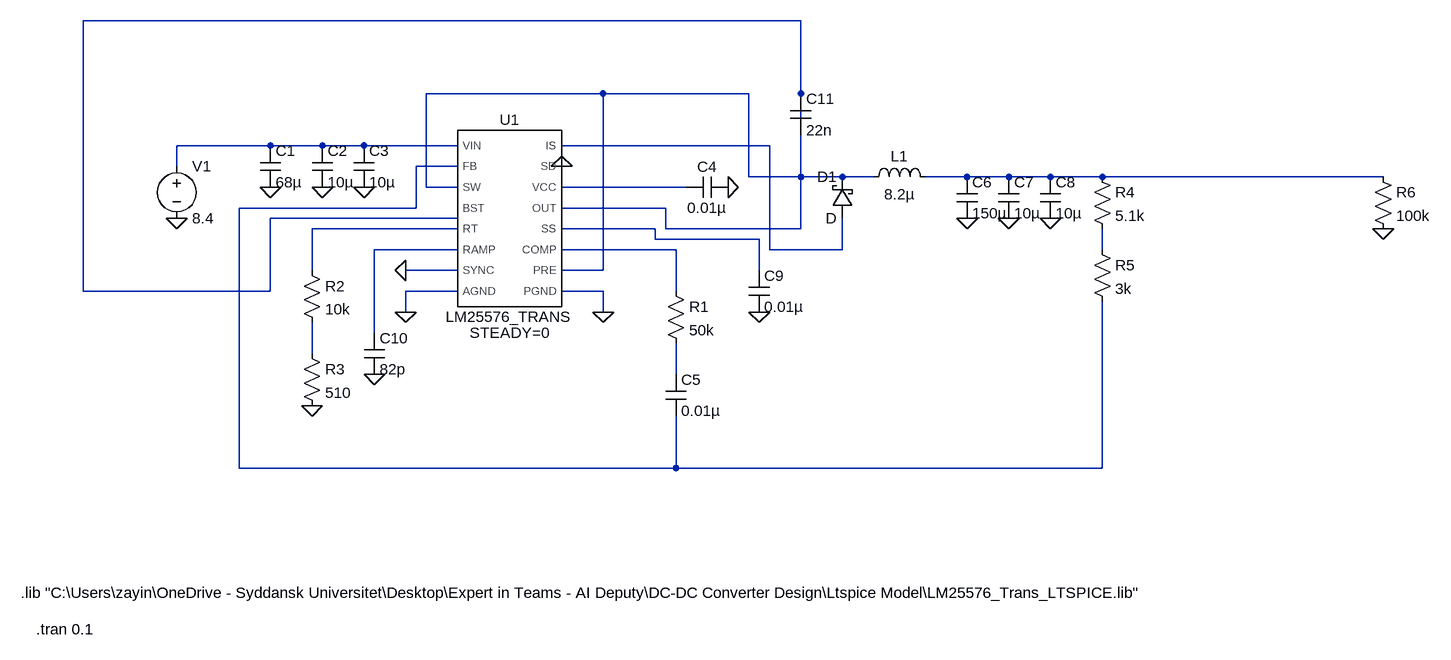
[diagram p0: schematic LM25576_LTSPICE_Simulation.asc]
LM25576_LTSPICE_Simulation.asc, the LTspice schematic file:
Version 4.1
SHEET 1 1616 824
WIRE 640 -128 -464 -128
WIRE 336 -16 64 -16
WIRE 560 -16 336 -16
WIRE 640 -16 640 -128
WIRE 640 32 640 -16
WIRE -176 64 -320 64
WIRE -96 64 -176 64
WIRE -32 64 -96 64
WIRE 112 64 -32 64
WIRE 592 64 272 64
WIRE -320 96 -320 64
WIRE 112 96 48 96
WIRE 560 112 560 -16
WIRE 640 112 640 48
WIRE 640 112 560 112
WIRE 704 112 640 112
WIRE 752 112 704 112
WIRE 896 112 832 112
WIRE 960 112 896 112
WIRE 1024 112 960 112
WIRE 1104 112 1024 112
WIRE 1536 112 1104 112
WIRE 64 128 64 -16
WIRE 112 128 64 128
WIRE 464 128 272 128
WIRE 48 160 48 96
WIRE 48 160 -224 160
WIRE 432 160 272 160
WIRE 112 176 112 160
WIRE 112 176 -176 176
WIRE 112 192 -112 192
WIRE 416 192 272 192
WIRE 432 192 432 160
WIRE 640 192 640 112
WIRE 640 192 432 192
WIRE 416 208 416 192
WIRE 576 208 416 208
WIRE 112 224 -16 224
WIRE 448 224 272 224
WIRE 592 224 592 64
WIRE 704 224 704 176
WIRE 704 224 592 224
WIRE 1104 224 1104 192
WIRE -112 256 -112 192
WIRE 112 256 32 256
WIRE 336 256 336 -16
WIRE 336 256 272 256
WIRE 576 256 576 208
WIRE -464 288 -464 -128
WIRE -176 288 -176 176
WIRE -176 288 -464 288
WIRE 112 288 32 288
WIRE 336 288 272 288
WIRE 448 288 448 224
WIRE 32 320 32 288
WIRE 336 320 336 288
WIRE -16 352 -16 224
WIRE -112 384 -112 336
WIRE 448 416 448 368
WIRE -224 560 -224 160
WIRE 448 560 448 480
WIRE 448 560 -224 560
WIRE 1104 560 1104 304
WIRE 1104 560 448 560
FLAG -320 176 0
FLAG 32 320 0
FLAG 336 320 0
FLAG -176 128 0
FLAG -96 128 0
FLAG -32 128 0
FLAG 32 256 0
FLAG -112 464 0
FLAG 528 128 0
FLAG 1536 192 0
FLAG 272 96 0
FLAG 576 320 0
FLAG -16 416 0
FLAG 896 176 0
FLAG 960 176 0
FLAG 1024 176 0
SYMBOL LM25576_TRANS 192 176 R0
SYMATTR InstName U1
SYMBOL voltage -320 80 R0
WINDOW 123 0 0 Left 0
WINDOW 39 0 0 Left 0
SYMATTR InstName V1
SYMATTR Value 8.4
SYMBOL cap -192 64 R0
SYMATTR InstName C1
SYMATTR Value 68µ
SYMBOL cap -112 64 R0
SYMATTR InstName C2
SYMATTR Value 10µ
SYMBOL cap -48 64 R0
SYMATTR InstName C3
SYMATTR Value 10µ
SYMBOL res 432 272 R0
SYMATTR InstName R1
SYMATTR Value 50k
SYMBOL cap 432 416 R0
SYMATTR InstName C5
SYMATTR Value 0.01µ
SYMBOL res -128 240 R0
SYMATTR InstName R2
SYMATTR Value 10k
SYMBOL res -128 368 R0
SYMATTR InstName R3
SYMATTR Value 510
SYMBOL cap 528 112 R90
WINDOW 0 0 32 VBottom 2
WINDOW 3 32 32 VTop 2
SYMATTR InstName C4
SYMATTR Value 0.01µ
SYMBOL schottky 720 176 R180
WINDOW 0 24 64 Left 2
WINDOW 3 24 0 Left 2
SYMATTR InstName D1
SYMBOL ind 736 128 R270
WINDOW 0 32 56 VTop 2
WINDOW 3 5 56 VBottom 2
SYMATTR InstName L1
SYMATTR Value 8.2µ
SYMBOL cap 880 112 R0
SYMATTR InstName C6
SYMATTR Value 150µ
SYMBOL cap 944 112 R0
SYMATTR InstName C7
SYMATTR Value 10µ
SYMBOL cap 1008 112 R0
SYMATTR InstName C8
SYMATTR Value 10µ
SYMBOL res 1088 96 R0
SYMATTR InstName R4
SYMATTR Value 5.1k
SYMBOL res 1088 208 R0
SYMATTR InstName R5
SYMATTR Value 3k
SYMBOL res 1520 96 R0
SYMATTR InstName R6
SYMATTR Value 100k
SYMBOL cap 560 256 R0
SYMATTR InstName C9
SYMATTR Value 0.01µ
SYMBOL cap -32 352 R0
SYMATTR InstName C10
SYMATTR Value 82p
SYMBOL cap 624 -16 R0
SYMATTR InstName C11
SYMATTR Value 22n
TEXT -536 808 Left 2 !.tran 0.1
TEXT -560 752 Left 2 !.lib "C:\\Users\\zayin\\OneDrive - Syddansk Universitet\\Desktop\\Expert in Teams - AI Deputy\\DC-DC Converter Design\\Ltspice Model\\LM25576_Trans_LTSPICE.lib"

The netlist it stands for:
* LM25576_LTSPICE_Simulation.asc
X§U1 N003 N005 N002 N001 N008 N010 0 0 N004 0 N007 N002 N009 N011 N002 0 LM25576_TRANS STEADY=0  ; pins VIN FB SW BST RT RAMP SYNC AGND IS SD VCC OUT SS COMP PRE PGND
V1 N003 0 8.4
C1 N003 0 68µ
C2 N003 0 10µ
C3 N003 0 10µ
R1 N011 N014 50k
C5 N014 N005 0.01µ
R2 N008 N013 10k
R3 N013 0 510
C4 0 N007 0.01µ
D1 N004 N002 D
L1 N002 N006 8.2µ
C6 N006 0 150µ
C7 N006 0 10µ
C8 N006 0 10µ
R4 N006 N012 5.1k
R5 N012 N005 3k
R6 N006 0 100k
C9 N009 0 0.01µ
C10 N010 0 82p
C11 N001 N002 22n
.model D D
.lib standard.dio
.tran 0.1
.lib "C:\Users\zayin\OneDrive - Syddansk Universitet\Desktop\Expert in Teams - AI Deputy\DC-DC Converter Design\Ltspice Model\LM25576_Trans_LTSPICE.lib"
.lib C:\Users\zayin\OneDrive - Syddansk Universitet\Desktop\Expert in Teams - AI Deputy\DC-DC Converter Design\Ltspice Model\LM25576_Trans_LTSPICE.lib
.backanno
.end